# Altium project OX_V1_RA.PrjPcb (part 2 of 2)

## Sheet AFE.SchDoc
size Legal
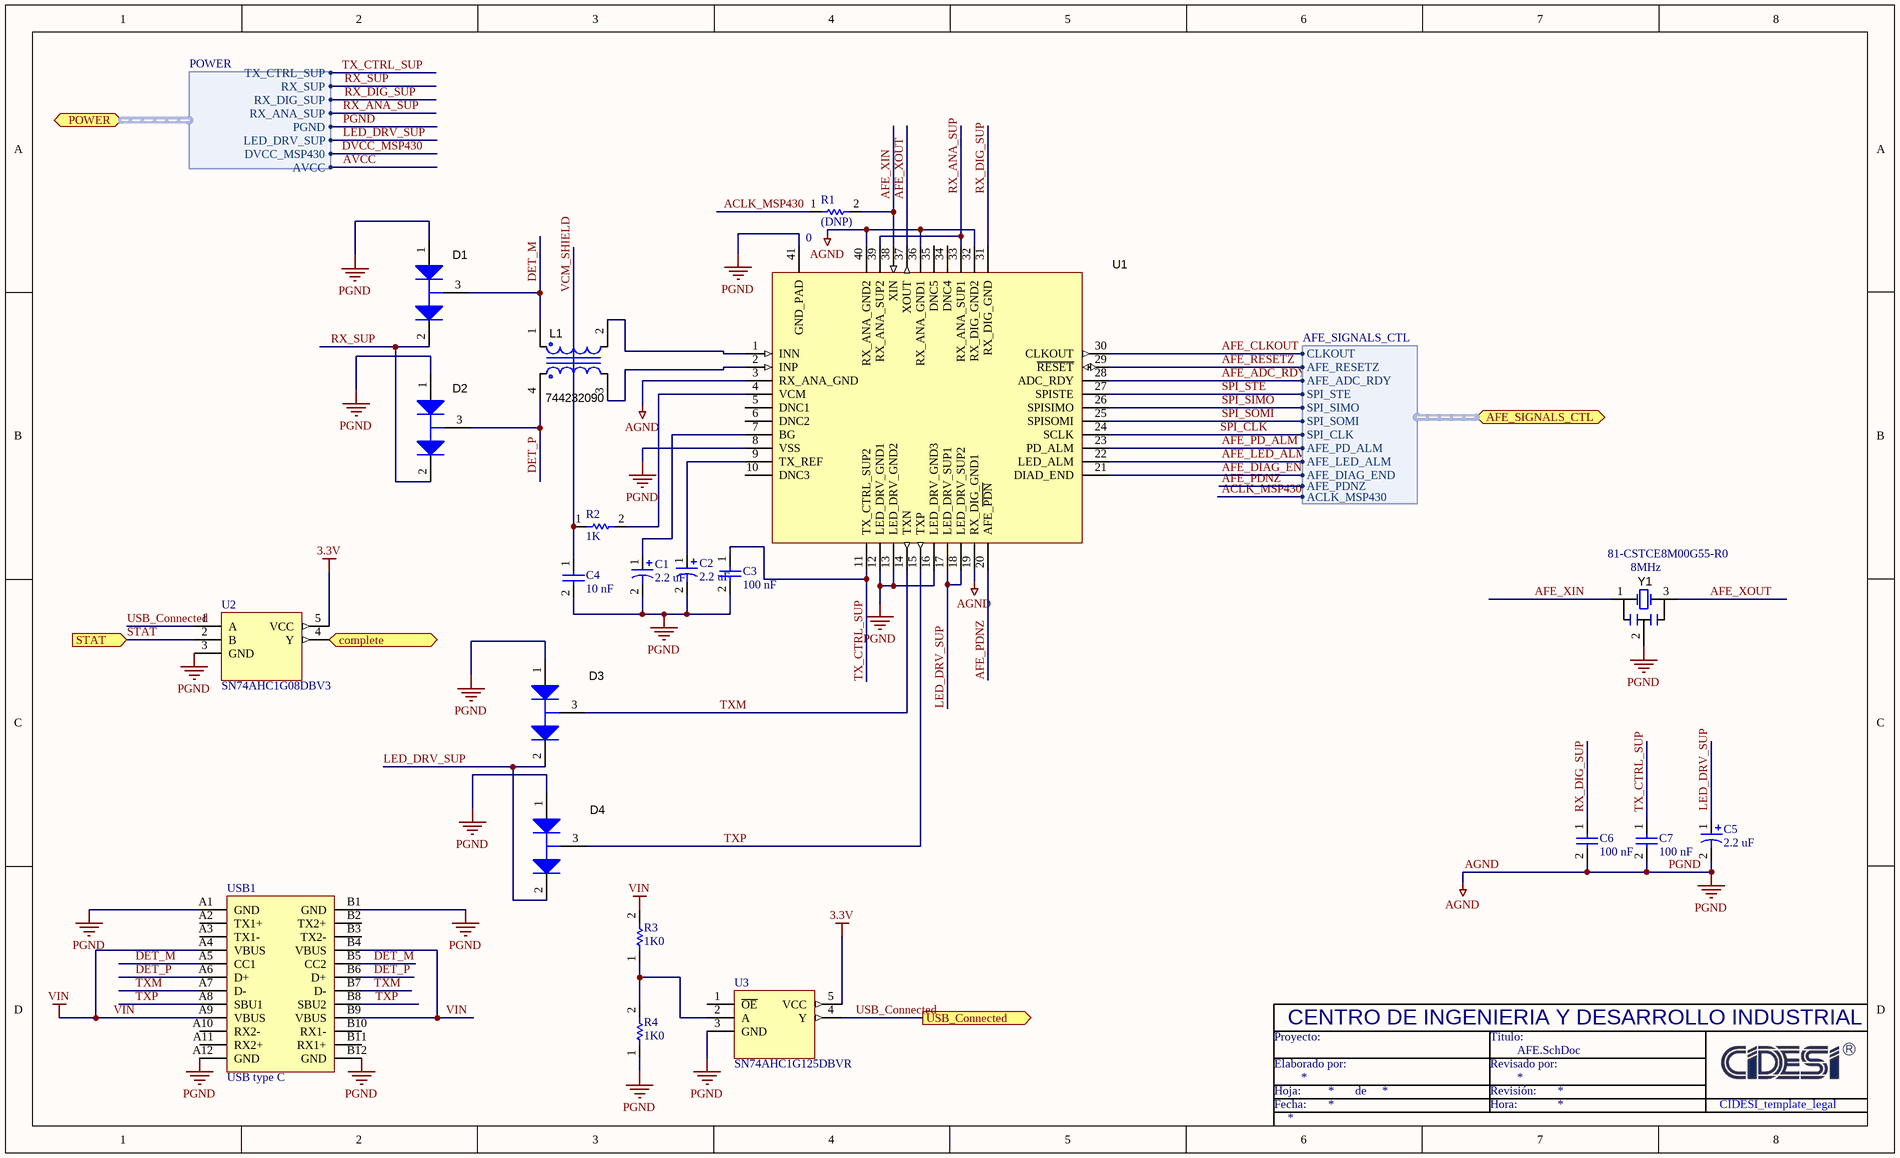
[diagram p3: AFE.SchDoc]

### Parts
C1  2.2 uF  [C0603_P]
C2  2.2 uF  [C0603_P]
C3  100 nF  [C0402]
C4  10 nF  [C0402]
C5  2.2 uF  [C0603_P]
C6  100 nF  [C0402]
C7  100 nF  [C0402]
D1  1651159  [SOT-323]  (value not drawn)
D2  1651159  [SOT-323]  (value not drawn)
D3  1651159  [SOT-323]  (value not drawn)
D4  1651159  [SOT-323]  (value not drawn)
L1  744232090  [IND_1206-4P]
R1  (DNP)  value 0  [0201]
R2  1K  [0201]
R3  Resistance: 1K0  [R-0402]  (hidden comment: CRCW04021K00FKEDC)
R4  Resistance: 1K0  [R-0402]  (hidden comment: CRCW04021K00FKEDC)
U1  (no value)  [QFN-40[RHA-42P]]
U2  (no value)  [SOT23-5]
U3  (no value)  [SOT23-5]
USB1  USB type C  [USB C]
Y1  value 8MHz  Supplier Part Number 1: 81-CSTCE8M00G55-R0  [RESONATOR-1.3X3.2-MURATA]  (hidden comment: CSTCE8M00G55-R0)

### Ports
AFE_SIGNALS_CTL (harness AFE_SIGNALS_CTL), complete (out), POWER (harness POWER), STAT (in), USB_Connected (out)

### Harnesses
POWER: AVCC, DVCC_MSP430, LED_DRV_SUP, PGND, RX_ANA_SUP, RX_DIG_SUP, RX_SUP, TX_CTRL_SUP
AFE_SIGNALS_CTL: CLKOUT, AFE_RESETZ, AFE_ADC_RDY, SPI_STE, SPI_SIMO, SPI_SOMI, SPI_CLK, AFE_PD_ALM, AFE_LED_ALM, AFE_DIAG_END, AFE_PDNZ, ACLK_MSP430

### Nets
3.3V: U2.5(VCC) U3.5(VCC)
AGND: C1.2(-) C2.2(-) C3.2 C4.2 C5.2(-) C6.2 C7.2 D1.1(A) D2.1(A) D3.1(A) D4.1(A) R4.1 U1.3(RX_ANA_GND) U1.8(VSS) U1.12(LED_DRV_GND1) U1.13(LED_DRV_GND2) U1.16(LED_DRV_GND3) U1.19(RX_DIG_GND1) U1.32(RX_DIG_GND2) U1.36(RX_ANA_GND1) U1.40(RX_ANA_GND2) U1.41(GND_PAD) U2.3(GND) U3.3(GND) USB1.A1(GND) USB1.A12(GND) USB1.B1(GND) USB1.B12(GND) Y1.2 ; port POWER.PGND  [also labelled PGND]
VIN: R3.2 USB1.A4(VBUS) USB1.A9(VBUS) USB1.B4(VBUS) USB1.B9(VBUS)
ACLK_MSP430: R1.1 ; port AFE_SIGNALS_CTL.ACLK_MSP430
AFE_ADC_RDY: U1.28(ADC_RDY) ; port AFE_SIGNALS_CTL.AFE_ADC_RDY
AFE_CLKOUT: U1.30(CLKOUT) ; port AFE_SIGNALS_CTL.CLKOUT
AFE_DIAG_END: U1.21(DIAD_END) ; port AFE_SIGNALS_CTL.AFE_DIAG_END
AFE_LED_ALM: U1.22(LED_ALM) ; port AFE_SIGNALS_CTL.AFE_LED_ALM
AFE_PD_ALM: U1.23(PD_ALM) ; port AFE_SIGNALS_CTL.AFE_PD_ALM
AFE_PDNZ: U1.20(AFE_~{PDN}) ; port AFE_SIGNALS_CTL.AFE_PDNZ
AFE_RESETZ: U1.29(~{RESET}) ; port AFE_SIGNALS_CTL.AFE_RESETZ
AFE_XIN: R1.2 U1.38(XIN) Y1.1
AFE_XOUT: U1.37(XOUT) Y1.3
complete: U2.4(Y) ; port complete
DET_M: D1.3(A_C) L1.1 USB1.A5(CC1) USB1.B5(CC2)
DET_P: D2.3(A_C) L1.4 USB1.A6(D+) USB1.B6(D+)
LED_DRV_SUP: C5.1(+) D3.2(C) D4.2(C) U1.17(LED_DRV_SUP1) U1.18(LED_DRV_SUP2) ; port POWER.LED_DRV_SUP
RX_ANA_SUP: U1.33(RX_ANA_SUP1) U1.39(RX_ANA_SUP2) ; port POWER.RX_ANA_SUP
RX_DIG_SUP: C6.1 U1.31(RX_DIG_GND) ; port POWER.RX_DIG_SUP
RX_SUP: D1.2(C) D2.2(C) ; port POWER.RX_SUP
SPI_CLK: U1.24(SCLK) ; port AFE_SIGNALS_CTL.SPI_CLK
SPI_SIMO: U1.26(SPISIMO) ; port AFE_SIGNALS_CTL.SPI_SIMO
SPI_SOMI: U1.25(SPISOMI) ; port AFE_SIGNALS_CTL.SPI_SOMI
SPI_STE: U1.27(SPISTE) ; port AFE_SIGNALS_CTL.SPI_STE
STAT: U2.2(B) ; port STAT
TX_CTRL_SUP: C3.1 C7.1 U1.11(TX_CTRL_SUP2) ; port POWER.TX_CTRL_SUP
TXM: D3.3(A_C) U1.14(TXN) USB1.A7(D-) USB1.B7(D-)
TXP: D4.3(A_C) U1.15(TXP) USB1.A8(SBU1) USB1.B8(SBU2)
USB_Connected: U2.1(A) U3.4(Y) ; port USB_Connected
VCM_SHIELD: C4.1 R2.1
NetC1_1: C1.1(+) U1.7(BG)
NetC2_1: C2.1(+) U1.9(TX_REF)
NetL1_2: L1.2 U1.1(INN)
NetL1_3: L1.3 U1.2(INP)
NetR2_2: R2.2 U1.4(VCM)
NetR3_1: R3.1 R4.2 U3.2(A)

Not connected (* = marked no-connect by the designer): U1 5(DNC1) 6(DNC2) 10(DNC3) 34(DNC4) 35(DNC5); U3 1(~{OE}); USB1 A2(TX1+) A3(TX1-) A10(RX2-) A11(RX2+) B2(TX2+) B3(TX2-) B10(RX1-) B11(RX1+)

### Notes on the sheet
- Proyecto:
- CENTRO DE INGENIERIA Y DESARROLLO INDUSTRIAL
- Titulo:
- Fecha:
- Hoja:
- Elaborado por:
- de
- Hora:
- Revisión:
- Revisado por:
- CIDESI_template_legal

### Library data of the parts
C1 C2 C5 = F981A225MMA: NICHICON - F981A225MMA - CAPACITOR TANT, 2.2UF, 10V, SMD 20%; Supplier 1: Farnell; Stock 1: 1985; Pricing 1: 1=0.224, 10=0.188, 100=0.135, 250=0.118, 500=0.104, 1000=0.093 (GBP); ComponentLink1URL: http://www.nichicon.co.jp/english/products/pdfs/e-f98.pdf; ComponentLink1Description: http://www.nichicon.co.jp/english/products/pdfs/e-f98.pdf; Supplier Part Number 1: 1848764; Manufacturer 1: NICHICON; Manufacturer Part Number 1: F981A225MMA; RoHS 1: YES; Value: 2.2 uF; Description 1: NICHICON - F981A225MMA - CAPACITOR TANT, 2.2UF, 10V, SMD 20%; Supplier 2: Mouser; Supplier Part Number 2: 647-F981A225MMA
C3 C6 C7 = C1005X7R1H104M050BB: TDK - C1005X7R1H104M050BB - CAP CERAMIC, 0.1UF, 50V, X7R, 0402; Value: 100 nF; Supplier 1: Farnell; Stock 1: 15712; Pricing 1: 1=0.021, 10=0.012, 100=0.01, 1000=0.009, 4000=0.009, 8000=0.009 (GBP); ComponentLink1URL: http://product.tdk.com/capacitor/mlcc/en/documents/mlcc_commercial_general_en.pdf; ComponentLink1Description: http://product.tdk.com/capacitor/mlcc/en/documents/mlcc_commercial_general_en.pdf; Supplier Part Number 1: 2354090; Manufacturer 1: TDK; Manufacturer Part Number 1: C1005X7R1H104M050BB; RoHS 1: YES; Description 1: TDK - C1005X7R1H104M050BB - CAP CERAMIC, 0.1UF, 50V, X7R, 0402; Supplier 2: Mouser; Supplier Part Number 2: 810-C1005X7R1H104M
C4 = C1005X7R1H103K050BB: TDK - C1005X7R1H103K050BB - CAP CERAMIC, 0.01UF, 50V, X7R, 0402; Product Range: TDK - C Series; Capacitance: 0.01; Capacitance Tolerance: ± 10%; Dielectric Characteristic: X7; Voltage Rating: 50; Capacitor Case Style: 0402 ^1005 Metric]; Value: 10 nF; Supplier 1: Farnell; Stock 1: 36; Pricing 1: 1=0.011, 10=0.005, 100=0.005, 1000=0.005, 2500=0.005 (GBP); Packaging: Cut Tape; MSL: -; ComponentLink1URL: http://product.tdk.com/capacitor/mlcc/en/documents/mlcc_commercial_general_en.pdf; ComponentLink1Description: http://product.tdk.com/capacitor/mlcc/en/documents/mlcc_commercial_general_en.pdf; Supplier Part Number 1: 2354088; Manufacturer 1: TDK; Manufacturer Part Number 1: C1005X7R1H103K050BB; RoHS 1: YES; Description 1: TDK - C1005X7R1H103K050BB - CAP CERAMIC, 0.01UF, 50V, X7R, 0402; Supplier 2: Mouser; Supplier Part Number 2: 810-C1005X7R1H103K
D1-D4 = BAV99WT1G: ON SEMICONDUCTOR - BAV99WT1G - DIODE SMALL SIGNAL, 750MA; POPULATE: Y; CONSIGNED: N; PART NUMBER: BAV99WT1G; MANUFACTURER: ON SEMICONDUCTOR; Supplier 1: Farnell; Supplier Part Number 1: 1651159; Manufacturer 1: ON SEMICONDUCTOR; Manufacturer Part Number 1: BAV99WT1G; RoHS 1: YES; Description 1: ON SEMICONDUCTOR - BAV99WT1G - DIODE SMALL SIGNAL, 750MA; Stock 1: 17968; Pricing 1: 1=0.071, 25=0.064, 50=0.052, 100=0.038, 500=0.0261, 1000=0.023 (GBP); ComponentLink1URL: http://www.onsemi.com/pub/Collateral/BAV99WT1-D.PDF; ComponentLink1Description: http://www.onsemi.com/pub/Collateral/BAV99WT1-D.PDF; Supplier 2: Mouser; Supplier Part Number 2: 863-BAV99WT1G
L1 = DLW31SN900SQ2L: WURTH ELEKTRONIK - 744232090 - FILTER, COMMON, EMI, 0.37A; Current Rating: 370; Voltage Rating: 50; Filter Terminals: SMD; SVHC: No SVHC (16-Dec-2013); External Depth: 1.6; External Length / Height: 1.9; External Width: 3.2; Impedance: 90; Resistance: 300; Supplier 1: Farnell; Supplier Part Number 1: 1636474; Manufacturer 1: WURTH ELEKTRONIK; Manufacturer Part Number 1: 744232090; RoHS 1: YES; Description 1: WURTH ELEKTRONIK - 744232090 - FILTER, COMMON, EMI, 0.37A; Stock 1: 1875; Pricing 1: 1=0.83, 10=0.81, 50=0.77, 100=0.75, 250=0.69 (GBP); Operating Temperature Max: +125; Operating Temperature Min: -40; Packaging: Cut Tape; Voltage Rating V DC: 50; ComponentLink1URL: http://www.farnell.com/datasheets/1735620.pdf; ComponentLink1Description: http://www.farnell.com/datasheets/1735620.pdf; ComponentLink2URL: http://www.farnell.com/cad/1670066.zip; ComponentLink2Description: http://www.farnell.com/cad/1670066.zip; Supplier 2: Mouser; Supplier Part Number 2: 81-DLW31SN900SQ2L
R1 = CRCW02010000Z0ED: VISHAY DALE - CRCW02010000Z0ED - RESISTOR, CHIP, JUMPER, ZERO OHM, 50mW, FULL REEL; Supplier 1: Farnell; Stock 1: 19995; Pricing 1: 10000=0.017, 20000=0.016, 30000=0.015 (GBP); ComponentLink1URL: http://www.vishay.com/docs/20035/dcrcwe3.pdf; ComponentLink1Description: http://www.vishay.com/docs/20035/dcrcwe3.pdf; Supplier Part Number 1: 2316008; Manufacturer 1: VISHAY DALE; Manufacturer Part Number 1: CRCW02010000Z0ED; RoHS 1: YES; Description 1: VISHAY DALE - CRCW02010000Z0ED - RESISTOR, CHIP, JUMPER, ZERO OHM, 50mW, FULL REEL; Supplier 2: Mouser; Supplier Part Number 2: 71-CRCW02010000Z0ED
R2 = CRCW02011K00FNED: VISHAY DALE - CRCW02011K00FNED - RESISTOR, THICK FILM CHIP, 1KOHM 50mW, 1%, FULL REEL; Value: 1K; Supplier 1: Farnell; Pricing 1: 10000=0.022, 20000=0.022, 30000=0.022, 50000=0.019 (GBP); ComponentLink1URL: http://www.vishay.com/docs/20035/dcrcwe3.pdf; ComponentLink1Description: http://www.vishay.com/docs/20035/dcrcwe3.pdf; Supplier Part Number 1: 2321243; Manufacturer 1: VISHAY DALE; Manufacturer Part Number 1: CRCW02011K00FNED; RoHS 1: YES; Description 1: VISHAY DALE - CRCW02011K00FNED - RESISTOR, THICK FILM CHIP, 1KOHM 50mW, 1%, FULL REEL; Supplier 2: Mouser; Supplier Part Number 2: 71-CRCW02011K00FNED
R3 R4 = CRCW04021K00FKEDC: Resistor; Manufacturer: Vishay / Dale; Power Rating: 62.5 mW (1/16 W); Temperature Coefficient: 100 PPM / C; Tolerance: 1 %; Voltage Rating: 50 V; Supplier 1: Mouser; Manufacturer Part Number: CRCW04021K00FKEDC; RoHS: RoHS Compliant By Exemption; Category: Thick Film Resistors - SMD; Stock 1: 284399; Pricing 1: 1=0.130, 10=0.042, 100=0.017, 1000=0.007, 2500=0.004, 10000=0.004 (MXN); Features: -; Height: 0.35 mm; Length: 1 mm; Package / Case: -; Packaging: Cut Tape; Product: Thick Film Resistors SMD; Series: CRCW-C e3; Technology: Thick Film; Termination Style: SMD/SMT; Width: 0.5 mm; Brand: Vishay / Dale; Mounting Style: PCB Mount; Case Code - in: 0402; Case Code - mm: 1005; Maximum Operating Temperature: + 155 C; Minimum Operating Temperature: - 55 C; Product Type: Thick Film Resistors; Standard Pack Qty: 10000; Subcategory: Resistors; RoHS - Mouser: E; Minimum Order Quantity: 1; Reeling: True; ComponentLink1URL: https://www.mouser.com/datasheet/2/427/crcwce3-1762584.pdf; ComponentLink1Description: https://www.mouser.com/datasheet/2/427/crcwce3-1762584.pdf; Supplier Part Number 1: 71-CRCW04021K00FKEDC
U1 = AFE4400: IC, INTEGRATED ANALOG FRONT-END FOR HEART RATE MONITORS AND LOW-COST PULSE OXIMETERS, QFN-40; MANUFACTURER: TEXAS INSTRUMENTS; Manufacturer Part Number 1: AFE4400RHAT; POPULATE: Y; Description 1: ADC / DAC Multichannel Intg AFE for Heart Rate Monitors; Input Type: Analog, Digital; Input Voltage: 3.3 V; Number of Converters: 1; Resolution: 22 bit; Conversion Rate: 1.3 kSPs; Interface Type: Serial (SPI); Number of Channels: 1 Channel; Maximum Power Dissipation: 2.84 mW; Supply Voltage - Max: 3.6 V; Supply Voltage - Min: 2 V; Product Status: New Product; PART NUMBER: AFE4400; CONSIGNED: Y; Supplier 1: Mouser; Supplier Part Number 1: 595-AFE4400RHAT; Manufacturer 1: Texas Instruments; RoHS 1: RoHS Compliant; Category: ADC / DAC Multichannel; Stock 1: 140; Pricing 1: 1=10.29, 10=9.26, 25=8.68, 50=8.44, 100=7.61, 250=6.99, 500=6.37, 750=5.89, 1000=5.14 (AUD); Package / Case: VQFN-40; Packaging: Reel; Series: AFE4400; Brand: Texas Instruments; Mounting Style: SMD/SMT; Maximum Operating Temperature: + 70 C; Minimum Operating Temperature: 0 C; Standard Pack Qty: 250; RoHS - Mouser: Y; Minimum Order Quantity: 1; Reeling: True; ComponentLink1URL: http://www.mouser.com/ds/2/405/sbas601f-317023.pdf; ComponentLink1Description: http://www.mouser.com/ds/2/405/sbas601f-317023.pdf
U2 = SN74AHC1G08DBV3: AND GATE; Manufacturer: Texas Instruments; Logic Family: AHC; Number of Gates: 1 Gate; Number of Input Lines: 2 Input; Number of Output Lines: 1 Output; High Level Output Current: - 8 mA; Low Level Output Current: 8 mA; Propagation Delay Time: 7 ns; Supply Voltage - Max: 5.5 V; Supply Voltage - Min: 2 V; Supplier 1: Mouser; RoHS: RoHS Compliant; Category: Logic Gates; Stock 1: 5086; Pricing 1: 1=0.559, 10=0.415, 100=0.282, 500=0.231, 1000=0.174, 3000=0.153 (MXN); Operating Temperature Range: - 55 C to + 125 C; Package / Case: SOT-23-5; Packaging: Cut Tape; Product: Single-Function Gate; Brand: Texas Instruments; Mounting Style: SMD/SMT; Logic Function: AND; Maximum Operating Temperature: + 125 C; Minimum Operating Temperature: - 55 C; Product Type: Logic Gates; Standard Pack Qty: 3000; Subcategory: Logic ICs; RoHS - Mouser: Y; Minimum Order Quantity: 1; Reeling: True; Supplier Part Number 1: 595-SN74AHC1G08DBV3; Manufacturer Part Number: SN74AHC1G08DBV3
U3 = SN74AHC1G125DBVR: BUFFER; Manufacturer: Texas Instruments; Function: Buffer/Line Driver; Output Type: 3-State; Quiescent Current: 1 uA; Logic Family: AHC; Logic Type: True; Number of Channels: 1 Channel; Number of Input Lines: 1 Input; Number of Output Lines: 1 Output; High Level Output Current: - 8 mA; Input Signal Type: Single-Ended; Low Level Output Current: 8 mA; Operating Supply Voltage: 2.5 V; Polarity: Non-Inverting; Propagation Delay Time: 11.5 ns, 7.5 ns; Supply Voltage - Max: 5.5 V; Supply Voltage - Min: 2 V; Supplier 1: Mouser; RoHS: RoHS Compliant; Category: Buffers & Line Drivers; Stock 1: 27469; Pricing 1: 1=0.390, 10=0.270, 100=0.113, 1000=0.077, 3000=0.060, 9000=0.051, 24000=0.047, 45000=0.044, 99000=0.042 (MXN); Height: 1.15 mm; Length: 2.9 mm; Operating Temperature Range: - 40 C to + 125 C; Package / Case: SOT-23-5; Packaging: Cut Tape; Series: SN74AHC1G125; Technology: CMOS; Width: 1.6 mm; Brand: Texas Instruments; Mounting Style: SMD/SMT; Supply Current - Max: 1 uA; Maximum Operating Temperature: + 125 C; Minimum Operating Temperature: - 40 C; Product Type: Buffers & Line Drivers; Standard Pack Qty: 3000; Subcategory: Logic ICs; RoHS - Mouser: Y; Minimum Order Quantity: 1; Reeling: True; Supplier Part Number 1: 595-SN74AHC1G125DBVR; Manufacturer Part Number: SN74AHC1G125DBVR
USB1 = USB C: Supplier 1: Mouser; Supplier Part Number 1: 656-DX07S024JJ2R1300
Y1 = CSTCE8M00G55-R0: CRYSTAL, PIEZO CERAMIC RESONATOR, 8.00 MHz, SMD, 0.5%, 33pF, SMD; MANUFACTURER: MURATA; POPULATE: Y; CONSIGNED: N; Description 1: Resonators 8Mhz; Frequency: 8 MHz; Frequency Stability: 0.2 %; Brand: Murata Electronics; PART NUMBER: CSTCE8M00G55-R0; Supplier 1: Mouser; Manufacturer 1: Murata; Manufacturer Part Number 1: CSTCE8M00G55-R0; RoHS 1: RoHS Compliant; Category: Resonators; Stock 1: 25583; Pricing 1: 1=0.594, 10=0.467, 100=0.375, 1000=0.316, 3000=0.286, 9000=0.277 (AUD); Dimensions: 1.3 mm W x 3.2 mm L x 0.7 mm H; Operating Temperature Range: - 20 C to + 80 C; Packaging: Reel; Series: CSTCE; Termination Style: SMD/SMT; Tolerance: 0.5 %; Type: Small-cap Chip Type; Product Category: Ceramic Resonators, SMD; Standard Pack Qty: 3000; Tradename: CERALOCK; RoHS - Mouser: Y; Minimum Order Quantity: 1; Reeling: True; ComponentLink1URL: http://search.murata.co.jp/Ceramy/CatalogAction.do?sHinnm=?&nbsp&sNHinnm=CSTCE8M00G55-R0&sNhin_key=CSTCE8M00G55-R0&sLang=en&sParam=CSTCE; ComponentLink1Description: http://search.murata.co.jp/Ceramy/CatalogAction.do?sHinnm=?&nbsp&sNHinnm=CSTCE8M00G55-R0&sNhin_key=CSTCE8M00G55-R0&sLang=en&sParam=CSTCE

## Nets that join several sheets
3.3V: SUPPLY (5 pins), AFE (U2.5 U3.5)
3V3: SUPPLY (C8.1 R5.2 R6.2), MCU (10 pins), POWER (6 pins)
AGND: SUPPLY (17 pins), MCU (14 pins), POWER (29 pins), AFE (29 pins)
Bateria_Out: SUPPLY (6 pins), POWER (C501.1 L501.1 R511.1 U501.2)
VIN: SUPPLY (D5.1 P2.3), AFE (5 pins)
/SD WIFI: SUPPLY (U5.8), MCU (U101.4)
ACLK_MSP430: MCU (U101.18), AFE (R1.1)
AFE_ADC_RDY: MCU (U101.31), AFE (U1.28)
AFE_CLKOUT: MCU (R102.1), AFE (U1.30)
AFE_DIAG_END: MCU (U101.28), AFE (U1.21)
AFE_LED_ALM: MCU (U101.33), AFE (U1.22)
AFE_PD_ALM: MCU (U101.32), AFE (U1.23)
AFE_PDNZ: MCU (U101.30), AFE (U1.20)
AFE_RESETZ: MCU (U101.29), AFE (U1.29)
ALCC: SUPPLY (R5.1 U4.1), MCU (U101.36)
AVCC: MCU (C101.1 C107.1 U101.11), POWER (L502.2)
complete: SUPPLY (P2.1), AFE (U2.4)
LED_DRV_SUP: POWER (C520.1 L505.2), AFE (5 pins)
RX_ANA_SUP: POWER (C517.1 L504.2), AFE (U1.33 U1.39)
RX_DIG_SUP: POWER (C516.1 L503.2), AFE (C6.1 U1.31)
RX_SUP: POWER (7 pins), AFE (D1.2 D2.2)
SCL: SUPPLY (U4.3), MCU (R521.1 U101.35)
SDA: SUPPLY (U4.2), MCU (R520.1 U101.34)
SPI_CLK: MCU (U101.44), AFE (U1.24)
SPI_SIMO: MCU (U101.42), AFE (U1.26)
SPI_SOMI: MCU (U101.43), AFE (U1.25)
SPI_STE: MCU (U101.41), AFE (U1.27)
STAT: SUPPLY (D6.2 U6.1), AFE (U2.2)
TX_CTRL_SUP: POWER (C521.1 L506.2), AFE (C3.1 C7.1 U1.11)
UART_TX: SUPPLY (P2.2), MCU (U101.38)
USB_Connected: SUPPLY (P2.4), AFE (U2.1 U3.4)